# EAGLE design mainboard (EAGLE 9.4.2)
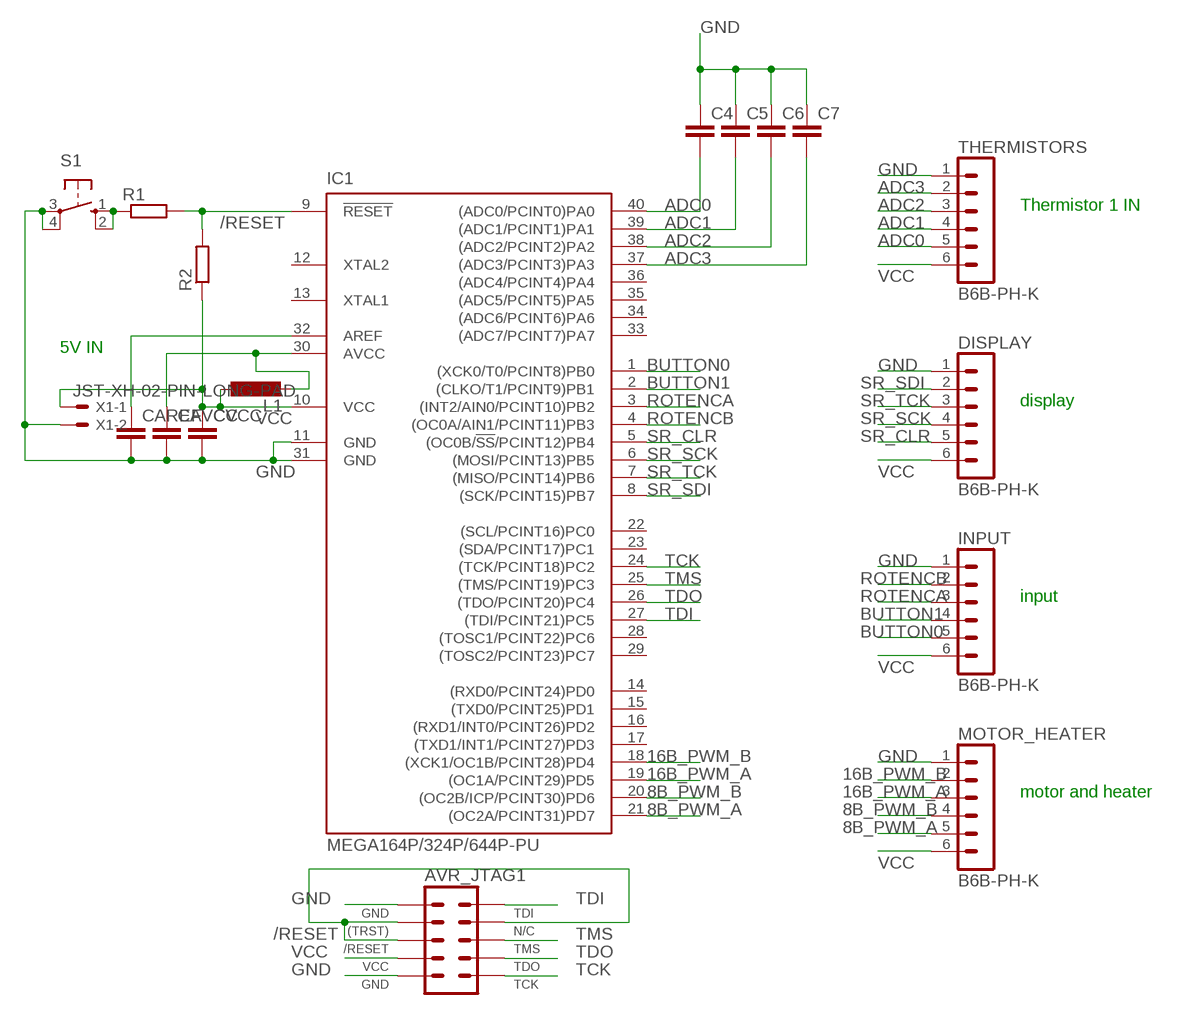
[diagram p0: schematic, sheet 1]

## Parts
AVR_JTAG1  AVR_JTAG_2X5/IN  [AVR_JTAG_2X5]
C4  C-EU025-024X044  [C025-024X044]
C5  C-EU025-024X044  [C025-024X044]
C6  C-EU025-024X044  [C025-024X044]
C7  C-EU025-024X044  [C025-024X044]
CAREF  C-EU025-024X044  [C025-024X044]
CAVCC  C-EU025-024X044  [C025-024X044]
CVCC  C-EU025-024X044  [C025-024X044]
DISPLAY  B6B-PH-K  [B6B-PH-K]
IC1  MEGA164P/324P/644P-PU  [DIL40]
INPUT  B6B-PH-K  [B6B-PH-K]
L1  L-EU0207/10  [0207/10]
MOTOR_HEATER  B6B-PH-K  [B6B-PH-K]
R1  R-EU_0207/10  [0207/10]
R2  R-EU_0207/10  [0207/10]
S1  10-XX  [B3F-10XX]
THERMISTORS  B6B-PH-K  [B6B-PH-K]
X1  JST-XH-02-PIN-LONG-PAD  [JST-XH-02-PACKAGE-LONG-PAD]

## Nets
8B_PWM_A: IC1.21((OC2A/PCINT31)PD7) MOTOR_HEATER.5
8B_PWM_B: IC1.20((OC2B/ICP/PCINT30)PD6) MOTOR_HEATER.4
16B_PWM_A: IC1.19((OC1A/PCINT29)PD5) MOTOR_HEATER.3
16B_PWM_B: IC1.18((XCK1/OC1B/PCINT28)PD4) MOTOR_HEATER.2
/RESET: AVR_JTAG1.6(/RESET) AVR_JTAG1.7(N/C) AVR_JTAG1.8((TRST)) IC1.9(!RESET) R1.2 R2.2
ADC0: C4.2 IC1.40((ADC0/PCINT0)PA0) THERMISTORS.5
ADC1: C5.2 IC1.39((ADC1/PCINT1)PA1) THERMISTORS.4
ADC2: C6.2 IC1.38((ADC2/PCINT2)PA2) THERMISTORS.3
ADC3: C7.2 IC1.37((ADC3/PCINT3)PA3) THERMISTORS.2
BUTTON0: IC1.1((XCK0/T0/PCINT8)PB0) INPUT.5
BUTTON1: IC1.2((CLKO/T1/PCINT9)PB1) INPUT.4
GND: AVR_JTAG1.2(GND1) AVR_JTAG1.10(GND2) C4.1 C5.1 C6.1 C7.1 CAREF.2 CAVCC.2 CVCC.2 DISPLAY.1 IC1.11(GND) IC1.31(GND) INPUT.1 MOTOR_HEATER.1 S1.3(P) S1.4(P1) THERMISTORS.1 X1.2
N$1: CAVCC.1 IC1.30(AVCC) L1.2
N$3: R1.1 S1.1(S) S1.2(S1)
N$9: CAREF.1 IC1.32(AREF)
ROTENCA: IC1.3((INT2/AIN0/PCINT10)PB2) INPUT.3
ROTENCB: IC1.4((OC0A/AIN1/PCINT11)PB3) INPUT.2
SR_CLR: DISPLAY.5 IC1.5((OC0B/!SS!/PCINT12)PB4)
SR_SCK: DISPLAY.4 IC1.6((MOSI/PCINT13)PB5)
SR_SDI: DISPLAY.2 IC1.8((SCK/PCINT15)PB7)
SR_TCK: DISPLAY.3 IC1.7((MISO/PCINT14)PB6)
TCK: AVR_JTAG1.1(TCK) IC1.24((TCK/PCINT18)PC2)
TDI: AVR_JTAG1.9(TDI) IC1.27((TDI/PCINT21)PC5)
TDO: AVR_JTAG1.3(TDO) IC1.26((TDO/PCINT20)PC4)
TMS: AVR_JTAG1.5(TMS) IC1.25((TMS/PCINT19)PC3)
VCC: AVR_JTAG1.4(VCC) CVCC.1 DISPLAY.6 IC1.10(VCC) INPUT.6 L1.1 MOTOR_HEATER.6 R2.1 THERMISTORS.6 X1.1
Unconnected: IC1.12(XTAL2) IC1.13(XTAL1) IC1.14((RXD0/PCINT24)PD0) IC1.15((TXD0/PCINT25)PD1) IC1.16((RXD1/INT0/PCINT26)PD2) IC1.17((TXD1/INT1/PCINT27)PD3) IC1.22((SCL/PCINT16)PC0) IC1.23((SDA/PCINT17)PC1) IC1.28((TOSC1/PCINT22)PC6) IC1.29((TOSC2/PCINT23)PC7) IC1.33((ADC7/PCINT7)PA7) IC1.34((ADC6/PCINT6)PA6) IC1.35((ADC5/PCINT5)PA5) IC1.36((ADC4/PCINT4)PA4)

## Notes on the sheet
- Thermistor 1 IN
- 5V IN
- display
- input
- motor and heater

## Library data of the parts
AVR_JTAG1 = customheaders:AVR_JTAG_2X5: HARTING
C4-C7 CAREF CAVCC CVCC = rcl:C-EU: CAPACITOR, European symbol; SPICEPREFIX: C
DISPLAY INPUT MOTOR_HEATER THERMISTORS = con-jst-ph:B6B-PH-K: HEADER
IC1 = avr-7:MEGA164P/324P/644P-PU
L1 = rcl:L-EU: INDUCTOR, European symbol; SPICEPREFIX: L
R1 R2 = rcl:R-EU_: RESISTOR, European symbol; SPICEPREFIX: R
S1 = switch-omron:10-XX: OMRON SWITCH
X1 = Rembrandt Electronics - JST XH Connectors v1-0:JST-XH-02-PIN: JST XH Connector 2 Pin Wire to board connector. Pitch: 2,54 mm, (0.100") Number of pins: 2 Created by Rembrandt Electronics www.rembrandtelectronics.com

## Board
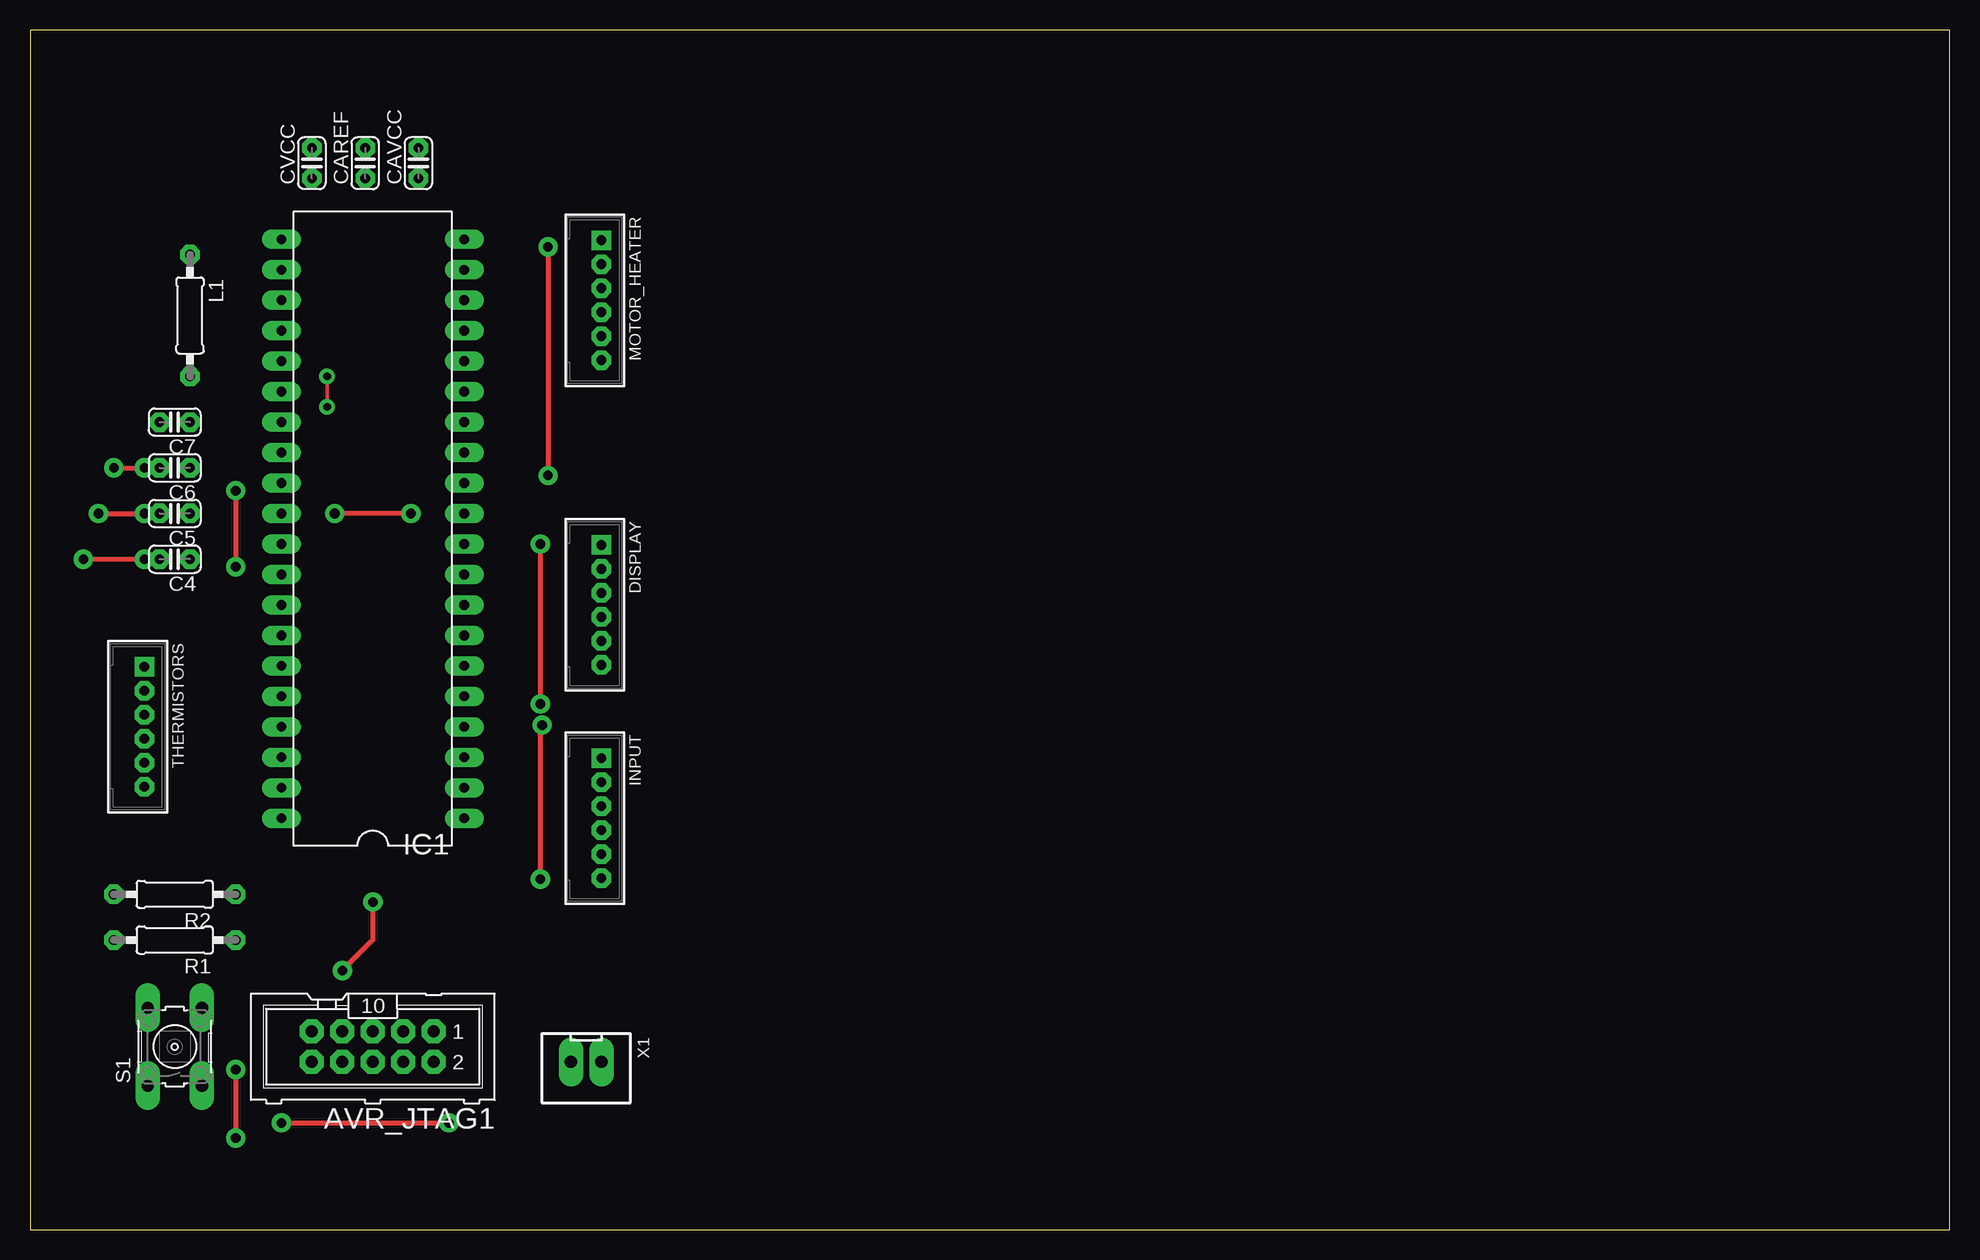
[diagram p1: board, top side]
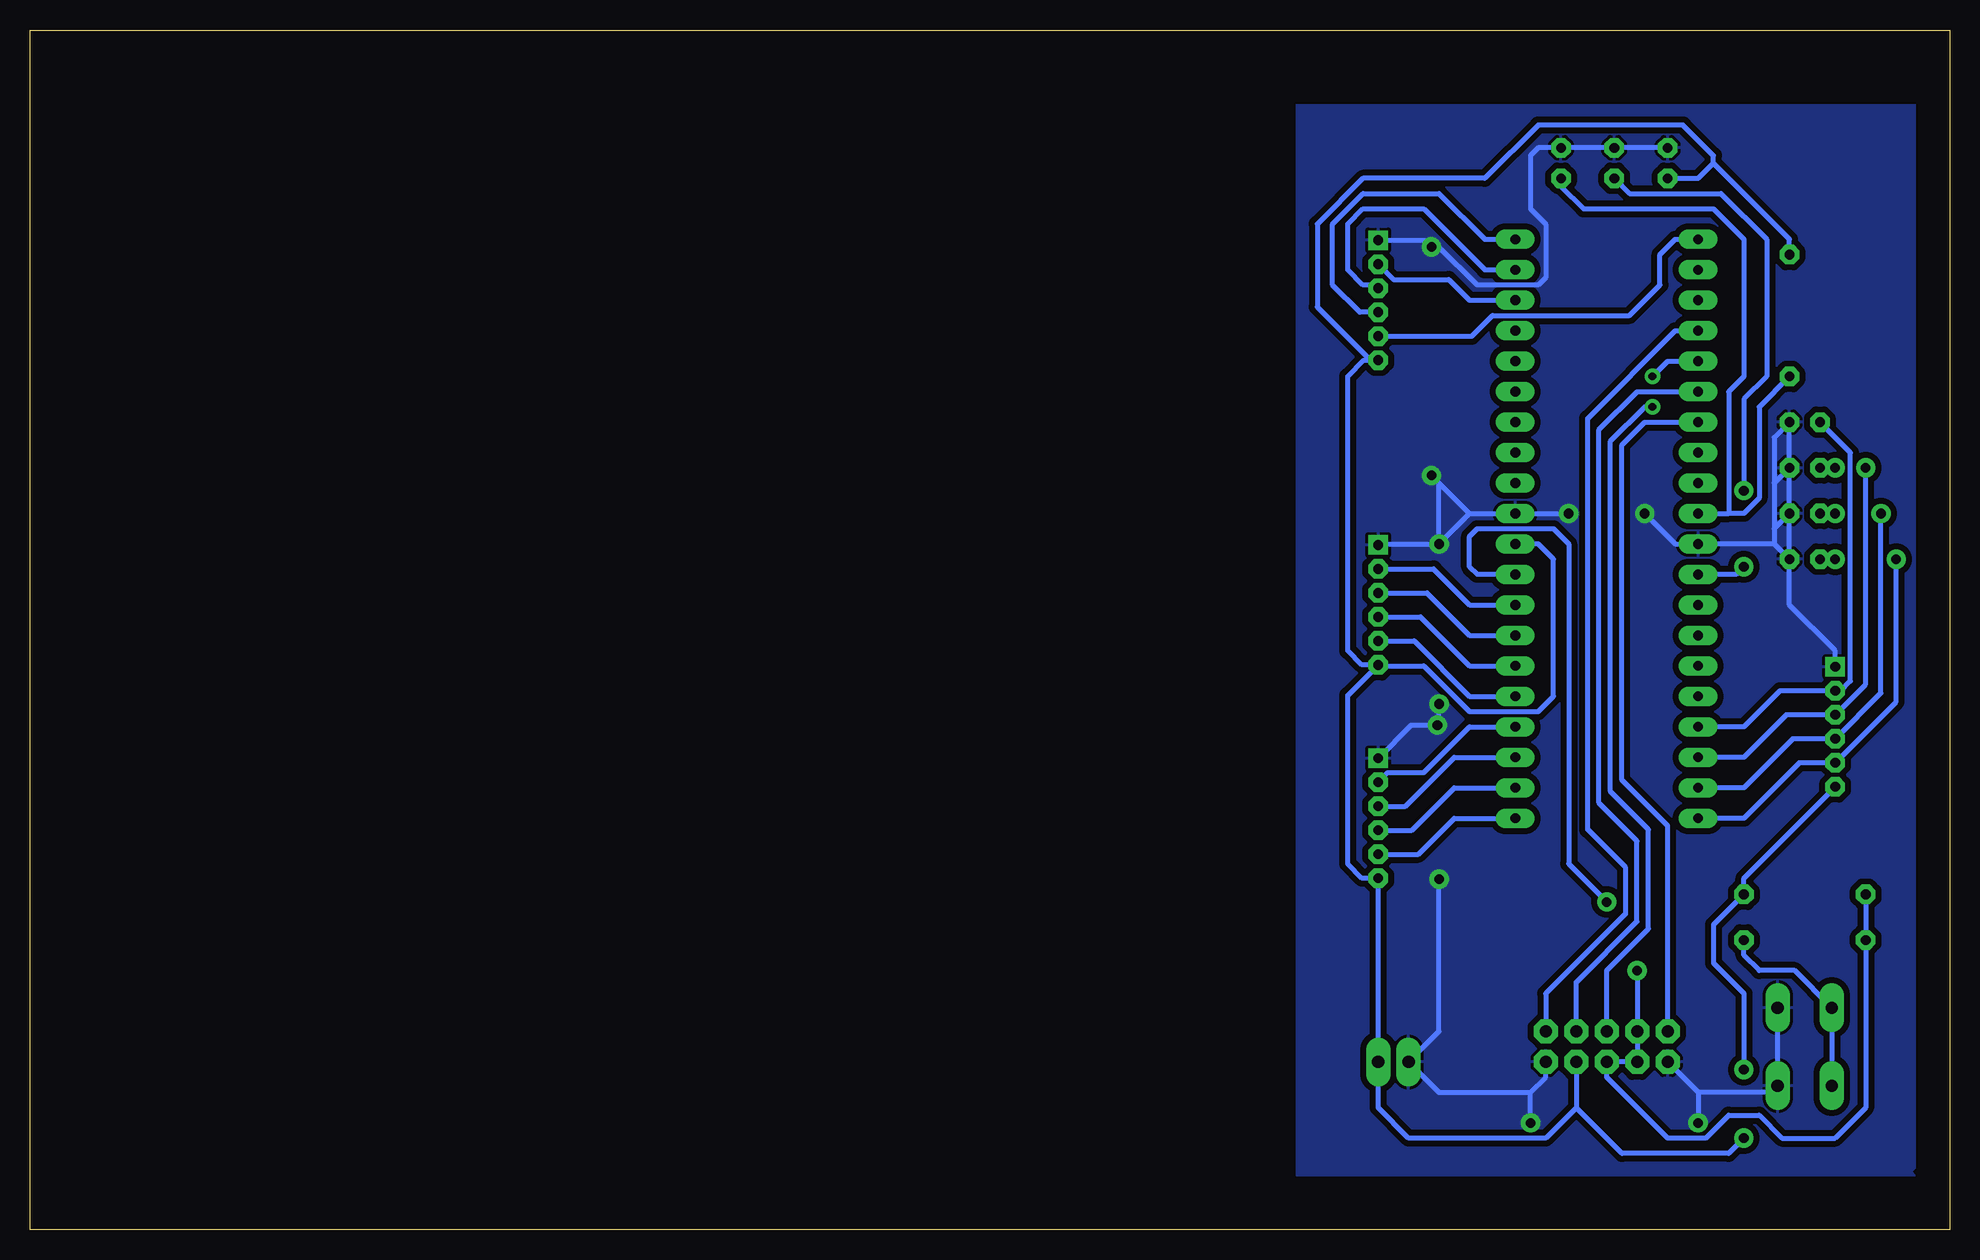
[diagram p2: board, bottom side, seen from below]

Size 160 x 100 mm. Coordinates in mm from the lower left corner, seen from the top.
Outline: 0,0 160,0 160,100 0,100 0,0
Copper layers (1*16): Top 0.035mm / dielectric 1.5mm / Bottom 0.035mm
Design rules "default *": minimum track width 0.3mm, minimum drill 0.65mm, track to track 6mil, track to pad 6mil, pad to pad 6mil, via to via 6mil, smd to smd 6mil, copper to edge 40mil, drill to drill 6mil, minimum pad ring 10mil, minimum via ring 8mil, stop-mask expansion 4mil, vias tented up to drill 0mil, thermal gap 10mil

### Footprints (pad centres in the part's own frame; a part is rotated, then mirrored left to right if it is on the bottom)
AVR_JTAG_2X5 = drill 1 pad 1.778 octagon: 1 -5.08,-1.27; 2 -5.08,1.27; 3 -2.54,-1.27; 4 -2.54,1.27; 5 0,-1.27; 6 0,1.27; 7 2.54,-1.27; 8 2.54,1.27; 9 5.08,-1.27; 10 5.08,1.27
C025-024X044 = drill 0.813 octagon: 1 -1.27,0; 2 1.27,0
B6B-PH-K = drill 0.813 square: 1 -5,0 | drill 0.813 octagon: 2 -3,0; 3 -1,0; 4 1,0; 5 3,0; 6 5,0
DIL40 = drill 0.813 long: 1 -24.13,-7.62; 2 -21.59,-7.62; 3 -19.05,-7.62; 4 -16.51,-7.62; 5 -13.97,-7.62; 6 -11.43,-7.62; 7 -8.89,-7.62; 8 -6.35,-7.62; 9 -3.81,-7.62; 10 -1.27,-7.62; 11 1.27,-7.62; 12 3.81,-7.62; 13 6.35,-7.62; 14 8.89,-7.62; 15 11.43,-7.62; 16 13.97,-7.62; 17 16.51,-7.62; 18 19.05,-7.62; 19 21.59,-7.62; 20 24.13,-7.62; 21 24.13,7.62; 22 21.59,7.62; 23 19.05,7.62; 24 16.51,7.62; 25 13.97,7.62; 26 11.43,7.62; 27 8.89,7.62; 28 6.35,7.62; 29 3.81,7.62; 30 1.27,7.62; 31 -1.27,7.62; 32 -3.81,7.62; 33 -6.35,7.62; 34 -8.89,7.62; 35 -11.43,7.62; 36 -13.97,7.62; 37 -16.51,7.62; 38 -19.05,7.62; 39 -21.59,7.62; 40 -24.13,7.62
0207/10 = drill 0.813 octagon: 1 -5.08,0; 2 5.08,0
B3F-10XX = drill 1.016 long: 1 -3.251,2.261; 2 3.251,2.261; 3 -3.251,-2.261; 4 3.251,-2.261
JST-XH-02-PACKAGE-LONG-PAD = drill 1.016 long: 1 -1.27,0; 2 1.27,0

### Placement (x,y rotation side)
AVR_JTAG1  28.57,15.24 180 top
C4  12.06,55.88 180 top
C5  12.06,59.69 180 top
C6  12.06,63.5 180 top
C7  12.06,67.31 180 top
CAREF  27.94,88.9 90 top
CAVCC  32.38,88.9 90 top
CVCC  23.5,88.9 90 top
DISPLAY  47.62,52.07 270 top
IC1  28.57,58.42 90 top
INPUT  47.62,34.29 270 top
L1  13.34,76.2 270 top
MOTOR_HEATER  47.62,77.47 270 top
R1  12.06,24.13 180 top
R2  12.06,27.94 180 top
S1  12.06,15.24 90 top
THERMISTORS  9.53,41.91 270 top
X1  46.35,13.97 180 top

### Tracks (layer width: path | path; a pad name or v marks a point on that pad's centre or on a via)
8B_PWM_A
  Bottom 0.4: MOTOR_HEATER.5 39.83,74.47 38.1,76.2 26.67,76.2 24.13,78.74 24.13,81.28 22.86,82.55 IC1.21
8B_PWM_B
  Bottom 0.4: MOTOR_HEATER.4 49.16,76.47 51.44,78.74 51.44,83.82 48.9,86.36 42.55,86.36 38.73,82.55 IC1.20
16B_PWM_A
  Bottom 0.4: MOTOR_HEATER.3 47.9,78.74 48.9,78.74 50.16,80.01 50.16,83.82 48.9,85.09 43.81,85.09 38.73,80.01 IC1.19
16B_PWM_B
  Bottom 0.4: MOTOR_HEATER.2 46.35,79.2 41.73,79.2 40.01,77.47 IC1.18
/RESET  (via drill 0.8)
  Top 0.4: v28.57,27.3 28.57,24.13 v26.04,21.59
  Bottom 0.4: R2.2 R1.2 6.99,10.16 9.53,7.62 13.97,7.62 15.88,9.53 18.41,9.53 20.32,7.62 23.5,7.62 28.57,12.7 AVR_JTAG1.6 AVR_JTAG1.8 AVR_JTAG1.7 v26.04,21.59 | IC1.9 39.37,54.61 40.01,55.24 40.01,57.78 39.37,58.42 33.02,58.42 31.75,57.15 31.75,30.48 v28.57,27.3
ADC0  (via drill 0.8)
  Top 0.4: v4.45,55.88 v9.53,55.88
  Bottom 0.4: IC1.40 17.14,34.29 12.53,38.91 THERMISTORS.5 4.45,43.99 v4.45,55.88 | v9.53,55.88 C4.2
ADC1  (via drill 0.8)
  Top 0.4: v5.71,59.69 v9.53,59.69
  Bottom 0.4: IC1.39 17.14,36.83 13.06,40.91 THERMISTORS.4 5.71,44.72 v5.71,59.69 | v9.53,59.69 C5.2
ADC2  (via drill 0.8)
  Top 0.4: v6.99,63.5 v9.53,63.5
  Bottom 0.4: IC1.38 17.14,39.37 13.61,42.91 THERMISTORS.3 6.99,45.45 v6.99,63.5 | v9.53,63.5 C6.2
ADC3
  Bottom 0.4: IC1.37 17.14,41.91 14.14,44.91 THERMISTORS.2 9.06,44.91 8.26,45.72 8.26,64.77 C7.2
BUTTON0
  Bottom 0.4: INPUT.5 44.27,31.29 41.27,34.29 IC1.1
BUTTON1
  Bottom 0.4: INPUT.4 44.81,33.29 41.27,36.83 IC1.2
GND  (via drill 0.8)
  Top 0.4: v20.95,8.89 v34.92,8.89 | v42.55,29.21 42.55,41.91 v42.69,42.05 | v42.55,43.81 v42.55,57.15 | v43.18,81.92 v43.18,62.87 | v31.75,59.69 v25.4,59.69
  Bottom 0.4: 34.92,11.43 42.55,11.43 X1.2 42.55,16.51 v42.55,29.21 | 34.92,11.43 33.66,12.7 AVR_JTAG1.2 | AVR_JTAG1.10 20.95,11.43 | 14.61,11.43 20.95,11.43 | 20.95,11.43 v20.95,8.89 | v34.92,8.89 34.92,11.43 | S1.3 S1.4 | v42.55,43.81 42.55,42.2 v42.69,42.05 44.86,42.05 INPUT.1 | DISPLAY.1 47.55,57.15 v42.55,57.15 | THERMISTORS.1 9.53,48.26 13.34,52.07 C4.1 | C4.1 C5.1 | C5.1 C6.1 | C6.1 C7.1 14.61,66.04 14.61,62.23 | C4.1 14.61,57.15 | 14.61,57.15 IC1.31 22.86,57.15 v25.4,59.69 | C5.1 14.61,58.42 | 14.61,58.42 14.61,57.15 | C6.1 14.61,62.23 | 14.61,62.23 14.61,58.42 | v42.55,57.15 40.01,59.69 | 40.01,59.69 IC1.11 v31.75,59.69 | MOTOR_HEATER.1 43.73,82.47 v43.18,81.92 42.55,81.92 39.37,78.74 34.29,78.74 33.66,79.38 33.66,83.82 34.92,85.09 34.92,89.53 34.29,90.17 CAVCC.2 CAREF.2 CVCC.2 | 40.01,59.69 v43.18,62.87 42.55,62.23 v42.55,57.15
  Bottom 0.406: S1.3 14.61,11.71 14.61,11.43
  pour Bottom (isolate 0.5): 2.88,4.48 54.41,4.48 54.41,93.77 2.88,93.77 2.88,5.12 3.2,4.8
N$1
  Bottom 0.4: L1.2 15.88,68.58 15.88,60.96 17.14,59.69 18.41,59.69 | 19.68,59.69 18.41,59.69 | CAVCC.1 32.38,87 30.48,85.09 19.68,85.09 17.14,82.55 17.14,71.12 18.41,69.85 18.41,59.69
  Bottom 0.406: IC1.30 19.68,59.69
N$3
  Bottom 0.4: S1.1 S1.2 12.9,21.59 15.88,21.59 17.14,22.86 R1.1
N$9  (via drill 0.8)
  Top 0.4: v17.14,61.59 v17.14,55.24
  Bottom 0.4: CAREF.1 26.67,86.36 19.05,86.36 15.24,82.55 15.24,71.12 17.14,69.22 v17.14,61.59 | v17.14,55.24 17.78,54.61 IC1.32
ROTENCA
  Bottom 0.4: INPUT.3 45.35,35.29 41.27,39.37 IC1.3
ROTENCB
  Bottom 0.4: INPUT.2 46.81,38.1 43.81,38.1 40.01,41.91 IC1.4
SR_CLR
  Bottom 0.4: DISPLAY.5 44.62,49.07 40.01,44.45 IC1.5
SR_SCK
  Bottom 0.4: DISPLAY.4 44.09,51.07 40.01,46.99 IC1.6
SR_SDI
  Bottom 0.4: DISPLAY.2 43.01,55.07 40.01,52.07 IC1.8
SR_TCK
  Bottom 0.4: DISPLAY.3 43.55,53.07 40.01,49.53 IC1.7
TCK
  Bottom 0.4: IC1.24 22.86,74.93 30.16,67.62 30.16,33.34 27,30.17 27,26.34 33.66,19.68 AVR_JTAG1.1
TDI
  Bottom 0.4: AVR_JTAG1.9 23.5,33.66 27.3,37.47 27.3,65.41 25.4,67.31 IC1.27
TDO
  Bottom 0.4: AVR_JTAG1.3 31.11,20.61 26.05,25.68 26.05,32.4 29.21,35.56 29.21,66.67 26.04,69.85 IC1.26
TMS  (via drill 0.65)
  Top 0.3: v24.77,68.58 v24.77,71.12
  Bottom 0.4: v24.77,68.58 25.4,68.58 28.26,65.72 28.26,36.52 25.09,33.34 25.09,25.08 28.57,21.59 AVR_JTAG1.5 | v24.77,71.12 23.5,72.39 IC1.25
VCC  (via drill 0.8)
  Top 0.4: v17.14,13.34 v17.14,7.62
  Bottom 0.4: DISPLAY.6 50.16,44.53 50.16,30.48 48.98,29.29 INPUT.6 X1.1 47.62,10.16 45.09,7.62 33.66,7.62 31.11,10.16 | DISPLAY.6 48.98,47.07 50.16,48.26 50.16,71.12 48.81,72.47 48.26,72.47 | 48.26,72.47 MOTOR_HEATER.6 | AVR_JTAG1.4 31.11,10.16 | THERMISTORS.6 17.14,29.29 R2.1 19.68,25.4 19.68,22.23 17.14,19.68 v17.14,13.34 | DISPLAY.6 47.55,46.99 43.81,46.99 40.01,43.18 34.29,43.18 33.02,44.45 33.02,55.88 34.29,57.15 IC1.10 | v17.14,7.62 18.41,6.35 27.3,6.35 31.11,10.16 | L1.1 13.34,82.55 19.68,88.9 | CVCC.1 20.95,87.63 19.68,88.9 | 19.68,88.9 19.68,89.53 22.23,92.08 34.29,92.08 38.73,87.63 48.9,87.63 52.7,83.82 52.7,76.92 48.26,72.47